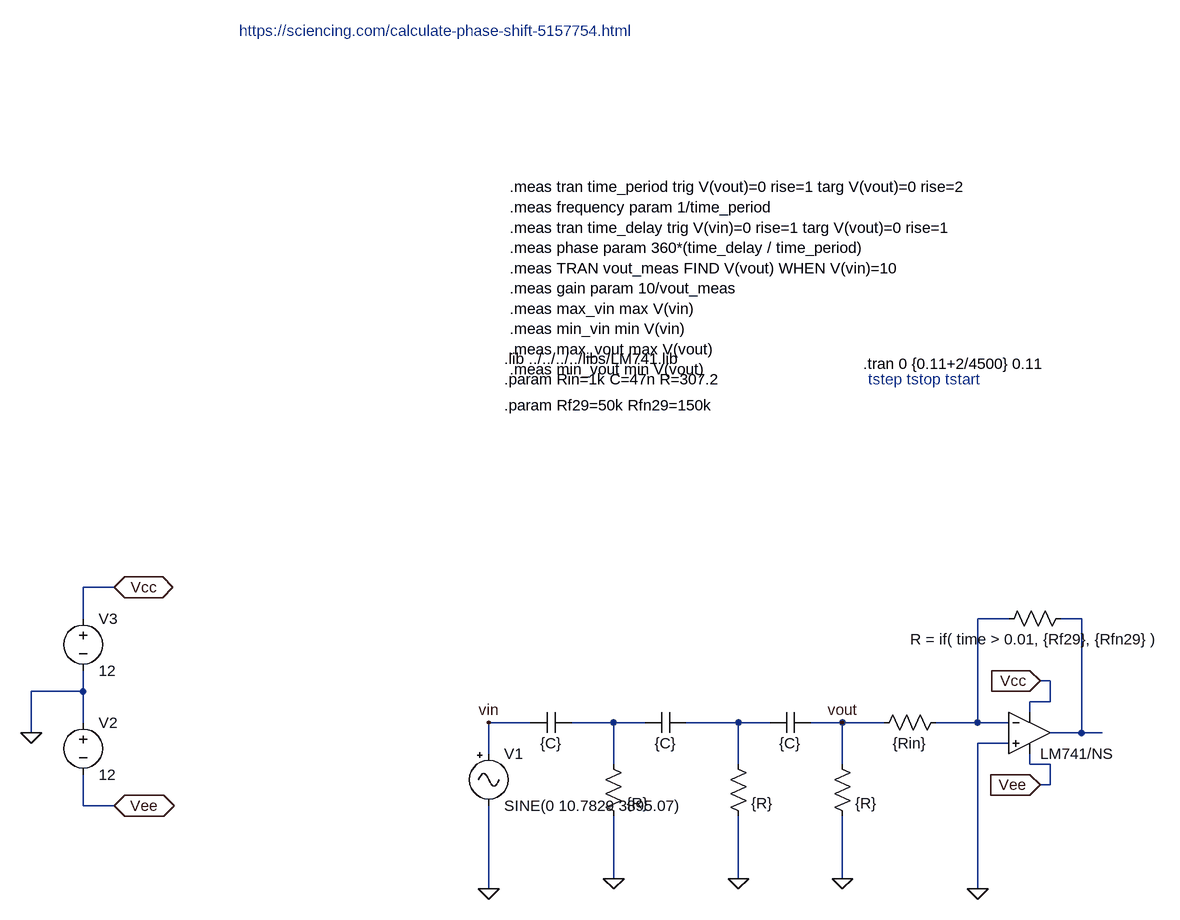
[diagram p0: schematic debugB_theorical.asc]
debugB_theorical.asc, the LTspice schematic file:
Version 4
SHEET 1 1316 1128
WIRE -704 -80 -752 -80
WIRE -752 -32 -752 -80
WIRE 672 -32 624 -32
WIRE 784 -32 752 -32
WIRE 736 64 720 64
WIRE -752 80 -752 48
WIRE -752 80 -832 80
WIRE 736 96 736 64
WIRE 736 96 704 96
WIRE 704 112 704 96
WIRE -752 128 -752 80
WIRE -64 128 -128 128
WIRE 64 128 0 128
WIRE 112 128 64 128
WIRE 256 128 176 128
WIRE 304 128 256 128
WIRE 416 128 368 128
WIRE 480 128 416 128
WIRE 624 128 624 -32
WIRE 624 128 560 128
WIRE 672 128 624 128
WIRE -832 144 -832 80
WIRE 784 144 784 -32
WIRE 784 144 736 144
WIRE 816 144 784 144
WIRE 672 160 624 160
WIRE -128 176 -128 128
WIRE 64 192 64 128
WIRE 256 192 256 128
WIRE 416 192 416 128
WIRE 704 192 704 176
WIRE 736 192 704 192
WIRE 736 224 736 192
WIRE 736 224 720 224
WIRE -752 256 -752 208
WIRE -704 256 -752 256
WIRE 64 368 64 272
WIRE 256 368 256 272
WIRE 416 368 416 272
WIRE -128 384 -128 256
WIRE 624 384 624 160
FLAG 64 368 0
FLAG 256 368 0
FLAG 720 64 Vcc
IOPIN 720 64 In
FLAG 720 224 Vee
IOPIN 720 224 In
FLAG 624 384 0
FLAG 416 368 0
FLAG -832 144 0
FLAG -704 -80 Vcc
IOPIN -704 -80 BiDir
FLAG -704 256 Vee
IOPIN -704 256 BiDir
FLAG 416 128 vout
FLAG -128 128 vin
FLAG -128 384 0
SYMBOL opamp2 704 80 R0
WINDOW 0 16 32 Invisible 2
SYMATTR InstName U1
SYMATTR Value LM741/NS
SYMBOL res 768 -48 R90
WINDOW 0 0 56 Invisible 2
WINDOW 3 32 56 VTop 2
SYMATTR InstName R1
SYMATTR Value R = if( time > 0.01, {Rf29}, {Rfn29} )
SYMBOL res 576 112 R90
WINDOW 0 0 56 Invisible 2
WINDOW 3 32 56 VTop 2
SYMATTR InstName R2
SYMATTR Value {Rin}
SYMBOL cap 0 112 R90
WINDOW 0 0 32 Invisible 2
WINDOW 3 32 32 VTop 2
SYMATTR InstName C1
SYMATTR Value {C}
SYMBOL cap 176 112 R90
WINDOW 0 0 32 Invisible 2
WINDOW 3 32 32 VTop 2
SYMATTR InstName C2
SYMATTR Value {C}
SYMBOL cap 368 112 R90
WINDOW 0 0 32 Invisible 2
WINDOW 3 32 32 VTop 2
SYMATTR InstName C3
SYMATTR Value {C}
SYMBOL res 48 176 R0
WINDOW 0 36 40 Invisible 2
SYMATTR InstName R3
SYMATTR Value {R}
SYMBOL res 240 176 R0
WINDOW 0 36 40 Invisible 2
SYMATTR InstName R4
SYMATTR Value {R}
SYMBOL res 400 176 R0
WINDOW 0 36 40 Invisible 2
SYMATTR InstName R5
SYMATTR Value {R}
SYMBOL voltage -752 112 R0
SYMATTR InstName V2
SYMATTR Value 12
SYMBOL voltage -752 -48 R0
SYMATTR InstName V3
SYMATTR Value 12
SYMBOL Misc/signal -128 160 R0
SYMATTR InstName V1
SYMATTR Value SINE(0 10.7829 3895.07)
TEXT -104 -432 Left 2 !.lib ../../../../libs/LM741.lib
TEXT -104 -400 Left 2 !.param Rin=1k C=47n R=307.2
TEXT 448 -424 Left 2 !.tran 0 {0.11+2/4500} 0.11
TEXT 456 -400 Left 2 ;tstep tstop tstart
TEXT -104 -360 Left 2 !.param Rf29=50k Rfn29=150k
TEXT -96 -696 Left 2 !.meas tran time_period trig V(vout)=0 rise=1 targ V(vout)=0 rise=2\n.meas frequency param 1/time_period\n.meas tran time_delay trig V(vin)=0 rise=1 targ V(vout)=0 rise=1\n.meas phase param 360*(time_delay / time_period)\n.meas TRAN vout_meas FIND V(vout) WHEN V(vin)=10\n.meas gain param 10/vout_meas\n.meas max_vin max V(vin)\n.meas min_vin min V(vin)\n.meas max_vout max V(vout)\n.meas min_vout min V(vout)
TEXT -512 -936 Left 2 ;https://sciencing.com/calculate-phase-shift-5157754.html

The netlist it stands for:
* debugB_theorical.asc
XU1 0 N001 Vcc Vee N002 LM741/NS  ; pins In+ In- V+ V- OUT
R1 N002 N001 R = if( time > 0.01, {Rf29}, {Rfn29} )
R2 N001 vout {Rin}
C1 N003 vin {C}
C2 N004 N003 {C}
C3 vout N004 {C}
R3 N003 0 {R}
R4 N004 0 {R}
R5 vout 0 {R}
V2 0 Vee 12
V3 Vcc 0 12
V1 vin 0 SINE(0 10.7829 3895.07)
.lib ../../../../libs/LM741.lib
.param Rin=1k C=47n R=307.2
.tran 0 {0.11+2/4500} 0.11
* tstep tstop tstart
.param Rf29=50k Rfn29=150k
.meas tran time_period trig V(vout)=0 rise=1 targ V(vout)=0 rise=2
.meas frequency param 1/time_period
.meas tran time_delay trig V(vin)=0 rise=1 targ V(vout)=0 rise=1
.meas phase param 360*(time_delay / time_period)
.meas TRAN vout_meas FIND V(vout) WHEN V(vin)=10
.meas gain param 10/vout_meas
.meas max_vin max V(vin)
.meas min_vin min V(vin)
.meas max_vout max V(vout)
.meas min_vout min V(vout)
* https://sciencing.com/calculate-phase-shift-5157754.html
.backanno
.end